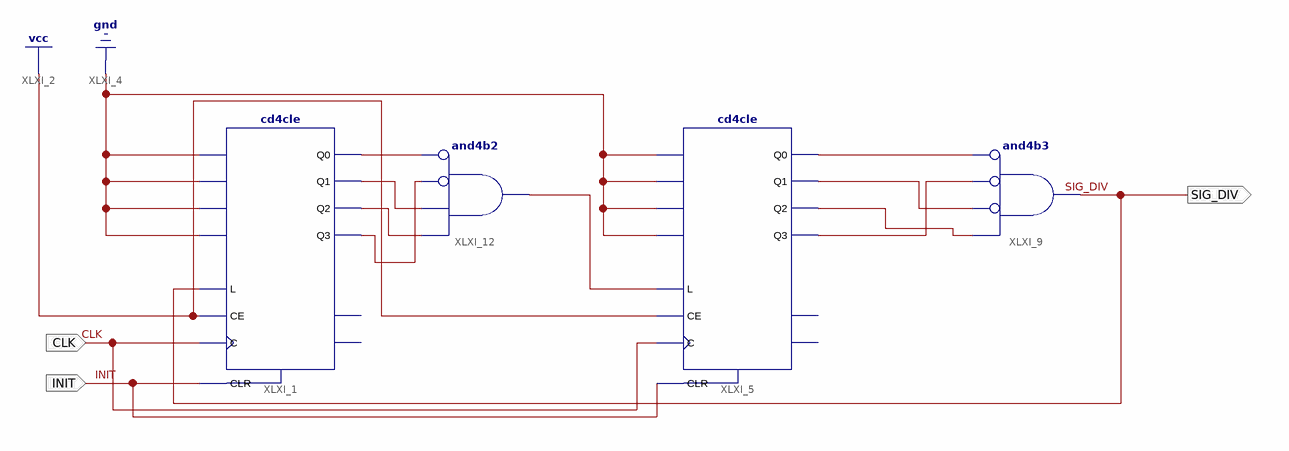
[diagram p0: schematic sheet 1]
// Xilinx ISE schematic ExamenP3ej2_v1.sch (spartan3) as structural Verilog: 4 symbols, 3 ports
module ExamenP3ej2_v1 (
  input  CLK,
  input  INIT,
  output SIG_DIV
);

  wire XLXN_3, XLXN_4, XLXN_5, XLXN_6, XLXN_22, XLXN_23, XLXN_24, XLXN_25, XLXN_36;

  cd4cle XLXI_1 (
    .C(CLK), .CE(1'b1), .CLR(INIT), .D0(1'b0), .D1(1'b0), .D2(1'b0), .D3(1'b0), .L(SIG_DIV), .Q0(XLXN_6),
    .Q1(XLXN_5), .Q2(XLXN_4), .Q3(XLXN_3));  // open: CEO, TC
  cd4cle XLXI_5 (
    .C(CLK), .CE(1'b1), .CLR(INIT), .D0(1'b0), .D1(1'b0), .D2(1'b0), .D3(1'b0), .L(XLXN_36), .Q0(XLXN_22),
    .Q1(XLXN_23), .Q2(XLXN_24), .Q3(XLXN_25));  // open: CEO, TC
  and XLXI_9 (SIG_DIV, ~XLXN_22, ~XLXN_25, ~XLXN_23, XLXN_24);  // and4b3
  and XLXI_12 (XLXN_36, ~XLXN_6, ~XLXN_3, XLXN_5, XLXN_4);  // and4b2
endmodule
